# Altium schematic sheet node24-main.SchDoc: Node24 TopLevel
size Tabloid; Author: Emergence Team; Engineer: asheem; Organization: Emergence; Address1: Oakland, California; Address2: a@aliengeometry.com; Address3: Black Rock City '18; Address4: OPEN SOURCE H/W; DocumentNumber: 1; Revision: Rev 0.1; SheetNumber: 1; SheetTotal: 6; SheetTitle: Node28 Main
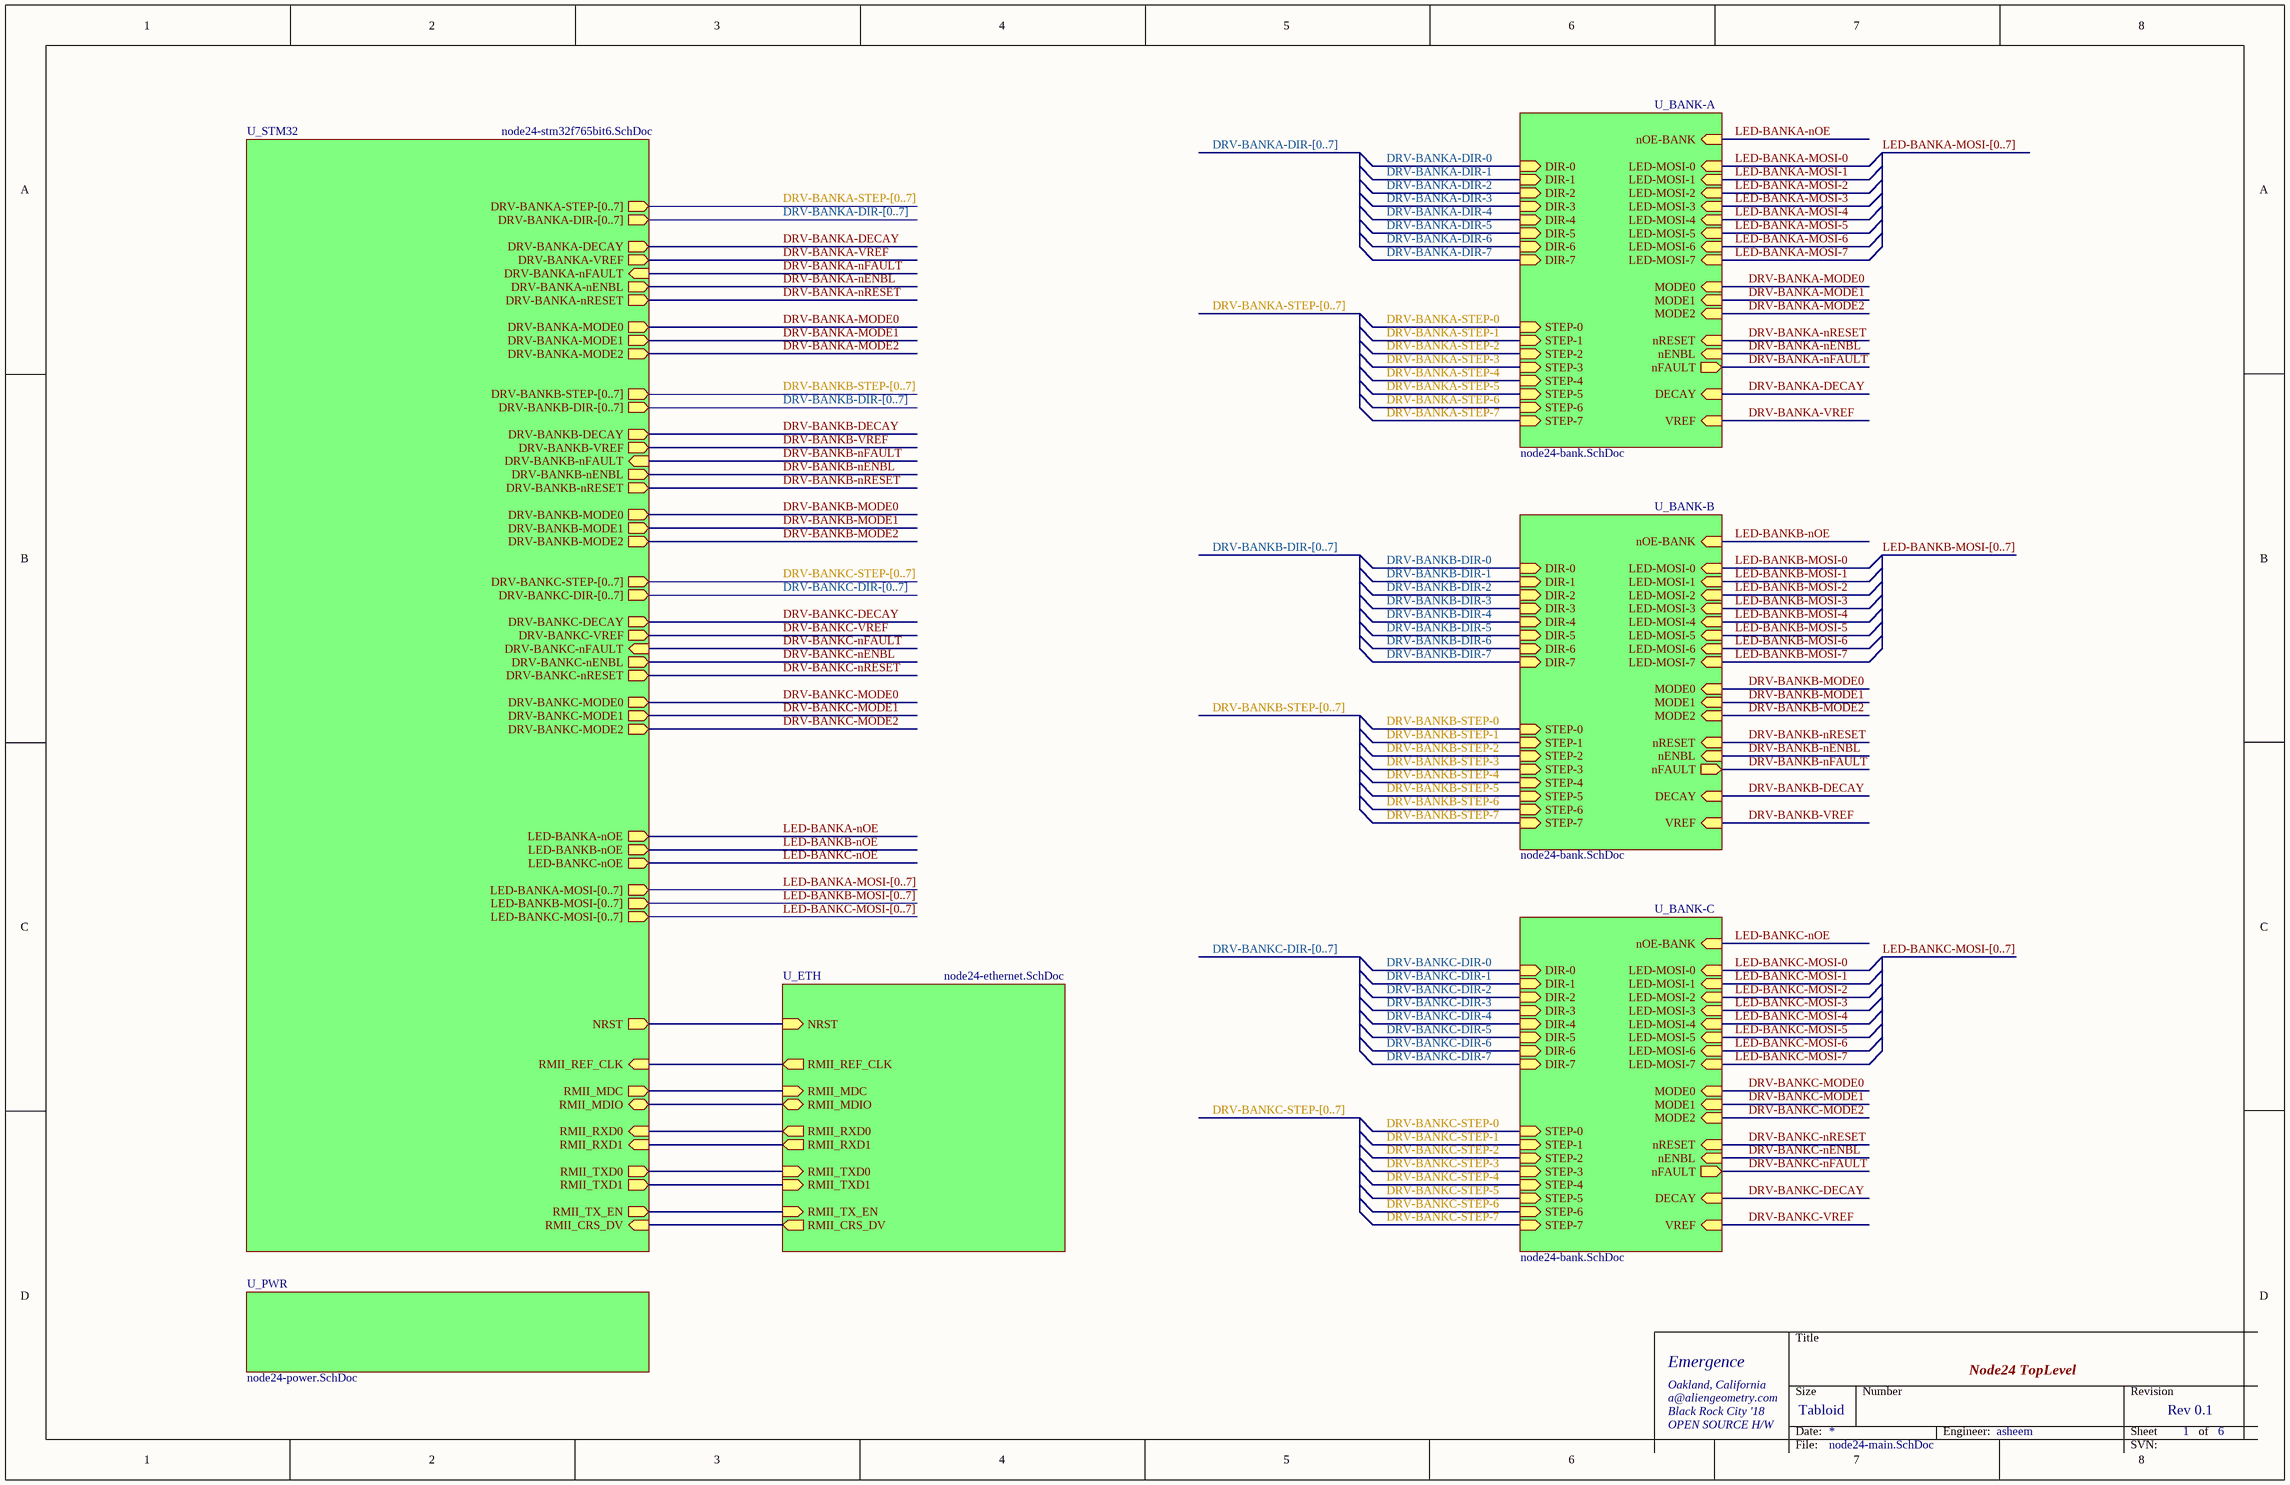
[diagram p0: node24-main.SchDoc]

## Sub-sheets
U_BANK-A = node24-bank.SchDoc: MODE0 (in), MODE1 (in), MODE2 (in), nENBL (in), VREF (in), nFAULT (out), nRESET (in), DECAY (in), DIR-0 (in), STEP-0 (in), DIR-1 (in), STEP-1 (in), DIR-2 (in), STEP-2 (in), DIR-3 (in), STEP-3 (in), DIR-5 (in), STEP-5 (in), DIR-6 (in), STEP-6 (in), DIR-7 (in), STEP-7 (in), DIR-4 (in), STEP-4 (in), LED-MOSI-3 (in), LED-MOSI-7 (in), LED-MOSI-6 (in), LED-MOSI-2 (in), LED-MOSI-1 (in), LED-MOSI-5 (in), LED-MOSI-4 (in), LED-MOSI-0 (in), nOE-BANK (in)
U_BANK-B = node24-bank.SchDoc: MODE0 (in), MODE1 (in), MODE2 (in), nENBL (in), VREF (in), nFAULT (out), nRESET (in), DECAY (in), DIR-0 (in), STEP-0 (in), DIR-1 (in), STEP-1 (in), DIR-2 (in), STEP-2 (in), DIR-3 (in), STEP-3 (in), DIR-5 (in), STEP-5 (in), DIR-6 (in), STEP-6 (in), DIR-7 (in), STEP-7 (in), DIR-4 (in), STEP-4 (in), LED-MOSI-3 (in), LED-MOSI-7 (in), LED-MOSI-6 (in), LED-MOSI-2 (in), LED-MOSI-1 (in), LED-MOSI-5 (in), LED-MOSI-4 (in), LED-MOSI-0 (in), nOE-BANK (in)
U_BANK-C = node24-bank.SchDoc: MODE0 (in), MODE1 (in), MODE2 (in), nENBL (in), VREF (in), nFAULT (out), nRESET (in), DECAY (in), DIR-0 (in), STEP-0 (in), DIR-1 (in), STEP-1 (in), DIR-2 (in), STEP-2 (in), DIR-3 (in), STEP-3 (in), DIR-5 (in), STEP-5 (in), DIR-6 (in), STEP-6 (in), DIR-7 (in), STEP-7 (in), DIR-4 (in), STEP-4 (in), LED-MOSI-3 (in), LED-MOSI-7 (in), LED-MOSI-6 (in), LED-MOSI-2 (in), LED-MOSI-1 (in), LED-MOSI-5 (in), LED-MOSI-4 (in), LED-MOSI-0 (in), nOE-BANK (in)
U_ETH = node24-ethernet.SchDoc: RMII_TXD0 (in), RMII_TX_EN (in), RMII_RXD0 (out), RMII_REF_CLK (out), RMII_CRS_DV (out), RMII_MDC (in), RMII_MDIO (bidir), NRST (in), RMII_TXD1 (in), RMII_RXD1 (out)
U_PWR = node24-power.SchDoc: no entries
U_STM32 = node24-stm32f765bit6.SchDoc: RMII_TXD0 (out), RMII_TX_EN (out), RMII_RXD0 (in), RMII_REF_CLK (in), RMII_CRS_DV (in), RMII_MDC (out), RMII_MDIO (bidir), RMII_TXD1 (out), RMII_RXD1 (in), NRST (out), DRV-BANKA-VREF (out), DRV-BANKA-DECAY (out), DRV-BANKA-nFAULT (in), DRV-BANKA-nENBL (out), DRV-BANKA-MODE0 (out), DRV-BANKA-MODE1 (out), DRV-BANKA-MODE2 (out), DRV-BANKB-DECAY (out), DRV-BANKB-VREF (out), DRV-BANKB-nFAULT (in), DRV-BANKB-nENBL (out), DRV-BANKB-MODE0 (out), DRV-BANKB-MODE1 (out), DRV-BANKB-MODE2 (out), DRV-BANKC-nENBL (out), DRV-BANKC-MODE0 (out), DRV-BANKC-MODE1 (out), DRV-BANKC-MODE2 (out), DRV-BANKC-DECAY (out), DRV-BANKC-VREF (out), DRV-BANKC-nFAULT (in), DRV-BANKB-STEP-[0..7] (out), DRV-BANKA-STEP-[0..7] (out), DRV-BANKB-DIR-[0..7] (out), DRV-BANKC-STEP-[0..7] (out), DRV-BANKA-DIR-[0..7] (out), DRV-BANKC-DIR-[0..7] (out), LED-BANKC-MOSI-[0..7] (out), LED-BANKB-MOSI-[0..7] (out), LED-BANKA-MOSI-[0..7] (out), LED-BANKC-nOE (out), LED-BANKB-nOE (out), LED-BANKA-nOE (out), DRV-BANKB-nRESET (out), DRV-BANKA-nRESET (out), DRV-BANKC-nRESET (out)

## Nets
DRV-BANKA-DECAY: sheet U_STM32/DRV-BANKA-DECAY, sheet U_BANK-A/DECAY
DRV-BANKA-DIR-0: sheet U_BANK-A/DIR-0
DRV-BANKA-DIR-1: sheet U_BANK-A/DIR-1
DRV-BANKA-DIR-2: sheet U_BANK-A/DIR-2
DRV-BANKA-DIR-3: sheet U_BANK-A/DIR-3
DRV-BANKA-DIR-4: sheet U_BANK-A/DIR-4
DRV-BANKA-DIR-5: sheet U_BANK-A/DIR-5
DRV-BANKA-DIR-6: sheet U_BANK-A/DIR-6
DRV-BANKA-DIR-7: sheet U_BANK-A/DIR-7
DRV-BANKA-MODE0: sheet U_STM32/DRV-BANKA-MODE0, sheet U_BANK-A/MODE0
DRV-BANKA-MODE1: sheet U_STM32/DRV-BANKA-MODE1, sheet U_BANK-A/MODE1
DRV-BANKA-MODE2: sheet U_STM32/DRV-BANKA-MODE2, sheet U_BANK-A/MODE2
DRV-BANKA-nENBL: sheet U_STM32/DRV-BANKA-nENBL, sheet U_BANK-A/nENBL
DRV-BANKA-nFAULT: sheet U_STM32/DRV-BANKA-nFAULT, sheet U_BANK-A/nFAULT
DRV-BANKA-nRESET: sheet U_STM32/DRV-BANKA-nRESET, sheet U_BANK-A/nRESET
DRV-BANKA-STEP-0: sheet U_BANK-A/STEP-0
DRV-BANKA-STEP-1: sheet U_BANK-A/STEP-1
DRV-BANKA-STEP-2: sheet U_BANK-A/STEP-2
DRV-BANKA-STEP-3: sheet U_BANK-A/STEP-3
DRV-BANKA-STEP-4: sheet U_BANK-A/STEP-4
DRV-BANKA-STEP-5: sheet U_BANK-A/STEP-5
DRV-BANKA-STEP-6: sheet U_BANK-A/STEP-6
DRV-BANKA-STEP-7: sheet U_BANK-A/STEP-7
DRV-BANKA-VREF: sheet U_STM32/DRV-BANKA-VREF, sheet U_BANK-A/VREF
DRV-BANKB-DECAY: sheet U_STM32/DRV-BANKB-DECAY, sheet U_BANK-B/DECAY
DRV-BANKB-DIR-0: sheet U_BANK-B/DIR-0
DRV-BANKB-DIR-1: sheet U_BANK-B/DIR-1
DRV-BANKB-DIR-2: sheet U_BANK-B/DIR-2
DRV-BANKB-DIR-3: sheet U_BANK-B/DIR-3
DRV-BANKB-DIR-4: sheet U_BANK-B/DIR-4
DRV-BANKB-DIR-5: sheet U_BANK-B/DIR-5
DRV-BANKB-DIR-6: sheet U_BANK-B/DIR-6
DRV-BANKB-DIR-7: sheet U_BANK-B/DIR-7
DRV-BANKB-MODE0: sheet U_STM32/DRV-BANKB-MODE0, sheet U_BANK-B/MODE0
DRV-BANKB-MODE1: sheet U_STM32/DRV-BANKB-MODE1, sheet U_BANK-B/MODE1
DRV-BANKB-MODE2: sheet U_STM32/DRV-BANKB-MODE2, sheet U_BANK-B/MODE2
DRV-BANKB-nENBL: sheet U_STM32/DRV-BANKB-nENBL, sheet U_BANK-B/nENBL
DRV-BANKB-nFAULT: sheet U_STM32/DRV-BANKB-nFAULT, sheet U_BANK-B/nFAULT
DRV-BANKB-nRESET: sheet U_STM32/DRV-BANKB-nRESET, sheet U_BANK-B/nRESET
DRV-BANKB-STEP-0: sheet U_BANK-B/STEP-0
DRV-BANKB-STEP-1: sheet U_BANK-B/STEP-1
DRV-BANKB-STEP-2: sheet U_BANK-B/STEP-2
DRV-BANKB-STEP-3: sheet U_BANK-B/STEP-3
DRV-BANKB-STEP-4: sheet U_BANK-B/STEP-4
DRV-BANKB-STEP-5: sheet U_BANK-B/STEP-5
DRV-BANKB-STEP-6: sheet U_BANK-B/STEP-6
DRV-BANKB-STEP-7: sheet U_BANK-B/STEP-7
DRV-BANKB-VREF: sheet U_STM32/DRV-BANKB-VREF, sheet U_BANK-B/VREF
DRV-BANKC-DECAY: sheet U_STM32/DRV-BANKC-DECAY, sheet U_BANK-C/DECAY
DRV-BANKC-DIR-0: sheet U_BANK-C/DIR-0
DRV-BANKC-DIR-1: sheet U_BANK-C/DIR-1
DRV-BANKC-DIR-2: sheet U_BANK-C/DIR-2
DRV-BANKC-DIR-3: sheet U_BANK-C/DIR-3
DRV-BANKC-DIR-4: sheet U_BANK-C/DIR-4
DRV-BANKC-DIR-5: sheet U_BANK-C/DIR-5
DRV-BANKC-DIR-6: sheet U_BANK-C/DIR-6
DRV-BANKC-DIR-7: sheet U_BANK-C/DIR-7
DRV-BANKC-MODE0: sheet U_STM32/DRV-BANKC-MODE0, sheet U_BANK-C/MODE0
DRV-BANKC-MODE1: sheet U_STM32/DRV-BANKC-MODE1, sheet U_BANK-C/MODE1
DRV-BANKC-MODE2: sheet U_STM32/DRV-BANKC-MODE2, sheet U_BANK-C/MODE2
DRV-BANKC-nENBL: sheet U_STM32/DRV-BANKC-nENBL, sheet U_BANK-C/nENBL
DRV-BANKC-nFAULT: sheet U_STM32/DRV-BANKC-nFAULT, sheet U_BANK-C/nFAULT
DRV-BANKC-nRESET: sheet U_STM32/DRV-BANKC-nRESET, sheet U_BANK-C/nRESET
DRV-BANKC-STEP-0: sheet U_BANK-C/STEP-0
DRV-BANKC-STEP-1: sheet U_BANK-C/STEP-1
DRV-BANKC-STEP-2: sheet U_BANK-C/STEP-2
DRV-BANKC-STEP-3: sheet U_BANK-C/STEP-3
DRV-BANKC-STEP-4: sheet U_BANK-C/STEP-4
DRV-BANKC-STEP-5: sheet U_BANK-C/STEP-5
DRV-BANKC-STEP-6: sheet U_BANK-C/STEP-6
DRV-BANKC-STEP-7: sheet U_BANK-C/STEP-7
DRV-BANKC-VREF: sheet U_STM32/DRV-BANKC-VREF, sheet U_BANK-C/VREF
LED-BANKA-MOSI-0: sheet U_BANK-A/LED-MOSI-0
LED-BANKA-MOSI-1: sheet U_BANK-A/LED-MOSI-1
LED-BANKA-MOSI-2: sheet U_BANK-A/LED-MOSI-2
LED-BANKA-MOSI-3: sheet U_BANK-A/LED-MOSI-3
LED-BANKA-MOSI-4: sheet U_BANK-A/LED-MOSI-4
LED-BANKA-MOSI-5: sheet U_BANK-A/LED-MOSI-5
LED-BANKA-MOSI-6: sheet U_BANK-A/LED-MOSI-6
LED-BANKA-MOSI-7: sheet U_BANK-A/LED-MOSI-7
LED-BANKA-nOE: sheet U_STM32/LED-BANKA-nOE, sheet U_BANK-A/nOE-BANK
LED-BANKB-MOSI-0: sheet U_BANK-B/LED-MOSI-0
LED-BANKB-MOSI-1: sheet U_BANK-B/LED-MOSI-1
LED-BANKB-MOSI-2: sheet U_BANK-B/LED-MOSI-2
LED-BANKB-MOSI-3: sheet U_BANK-B/LED-MOSI-3
LED-BANKB-MOSI-4: sheet U_BANK-B/LED-MOSI-4
LED-BANKB-MOSI-5: sheet U_BANK-B/LED-MOSI-5
LED-BANKB-MOSI-6: sheet U_BANK-B/LED-MOSI-6
LED-BANKB-MOSI-7: sheet U_BANK-B/LED-MOSI-7
LED-BANKB-nOE: sheet U_STM32/LED-BANKB-nOE, sheet U_BANK-B/nOE-BANK
LED-BANKC-MOSI-0: sheet U_BANK-C/LED-MOSI-0
LED-BANKC-MOSI-1: sheet U_BANK-C/LED-MOSI-1
LED-BANKC-MOSI-2: sheet U_BANK-C/LED-MOSI-2
LED-BANKC-MOSI-3: sheet U_BANK-C/LED-MOSI-3
LED-BANKC-MOSI-4: sheet U_BANK-C/LED-MOSI-4
LED-BANKC-MOSI-5: sheet U_BANK-C/LED-MOSI-5
LED-BANKC-MOSI-6: sheet U_BANK-C/LED-MOSI-6
LED-BANKC-MOSI-7: sheet U_BANK-C/LED-MOSI-7
LED-BANKC-nOE: sheet U_STM32/LED-BANKC-nOE, sheet U_BANK-C/nOE-BANK
(unnamed): sheet U_STM32/RMII_TXD0, sheet U_ETH/RMII_TXD0
(unnamed): sheet U_STM32/RMII_TX_EN, sheet U_ETH/RMII_TX_EN
(unnamed): sheet U_STM32/RMII_RXD0, sheet U_ETH/RMII_RXD0
(unnamed): sheet U_STM32/RMII_REF_CLK, sheet U_ETH/RMII_REF_CLK
(unnamed): sheet U_STM32/RMII_CRS_DV, sheet U_ETH/RMII_CRS_DV
(unnamed): sheet U_STM32/RMII_MDC, sheet U_ETH/RMII_MDC
(unnamed): sheet U_STM32/RMII_MDIO, sheet U_ETH/RMII_MDIO
(unnamed): sheet U_STM32/RMII_TXD1, sheet U_ETH/RMII_TXD1
(unnamed): sheet U_STM32/RMII_RXD1, sheet U_ETH/RMII_RXD1
(unnamed): sheet U_STM32/NRST, sheet U_ETH/NRST

## Buses and harness runs
bus DRV-BANKA-DIR-[0..7]
bus DRV-BANKA-DIR-[0..7] = sheet U_STM32/DRV-BANKA-DIR-[0..7]
bus DRV-BANKA-STEP-[0..7]
bus DRV-BANKA-STEP-[0..7] = sheet U_STM32/DRV-BANKA-STEP-[0..7]
bus DRV-BANKB-DIR-[0..7]
bus DRV-BANKB-DIR-[0..7] = sheet U_STM32/DRV-BANKB-DIR-[0..7]
bus DRV-BANKB-STEP-[0..7]
bus DRV-BANKB-STEP-[0..7] = sheet U_STM32/DRV-BANKB-STEP-[0..7]
bus DRV-BANKC-DIR-[0..7]
bus DRV-BANKC-DIR-[0..7] = sheet U_STM32/DRV-BANKC-DIR-[0..7]
bus DRV-BANKC-STEP-[0..7]
bus DRV-BANKC-STEP-[0..7] = sheet U_STM32/DRV-BANKC-STEP-[0..7]
bus LED-BANKA-MOSI-[0..7]
bus LED-BANKA-MOSI-[0..7] = sheet U_STM32/LED-BANKA-MOSI-[0..7]
bus LED-BANKB-MOSI-[0..7]
bus LED-BANKB-MOSI-[0..7] = sheet U_STM32/LED-BANKB-MOSI-[0..7]
bus LED-BANKC-MOSI-[0..7]
bus LED-BANKC-MOSI-[0..7] = sheet U_STM32/LED-BANKC-MOSI-[0..7]

## Notes on the sheet
- Title
- Size
- Date:
- Tabloid
- Number
- Engineer:
- Revision
- Sheet
- of
- File:
- SVN: